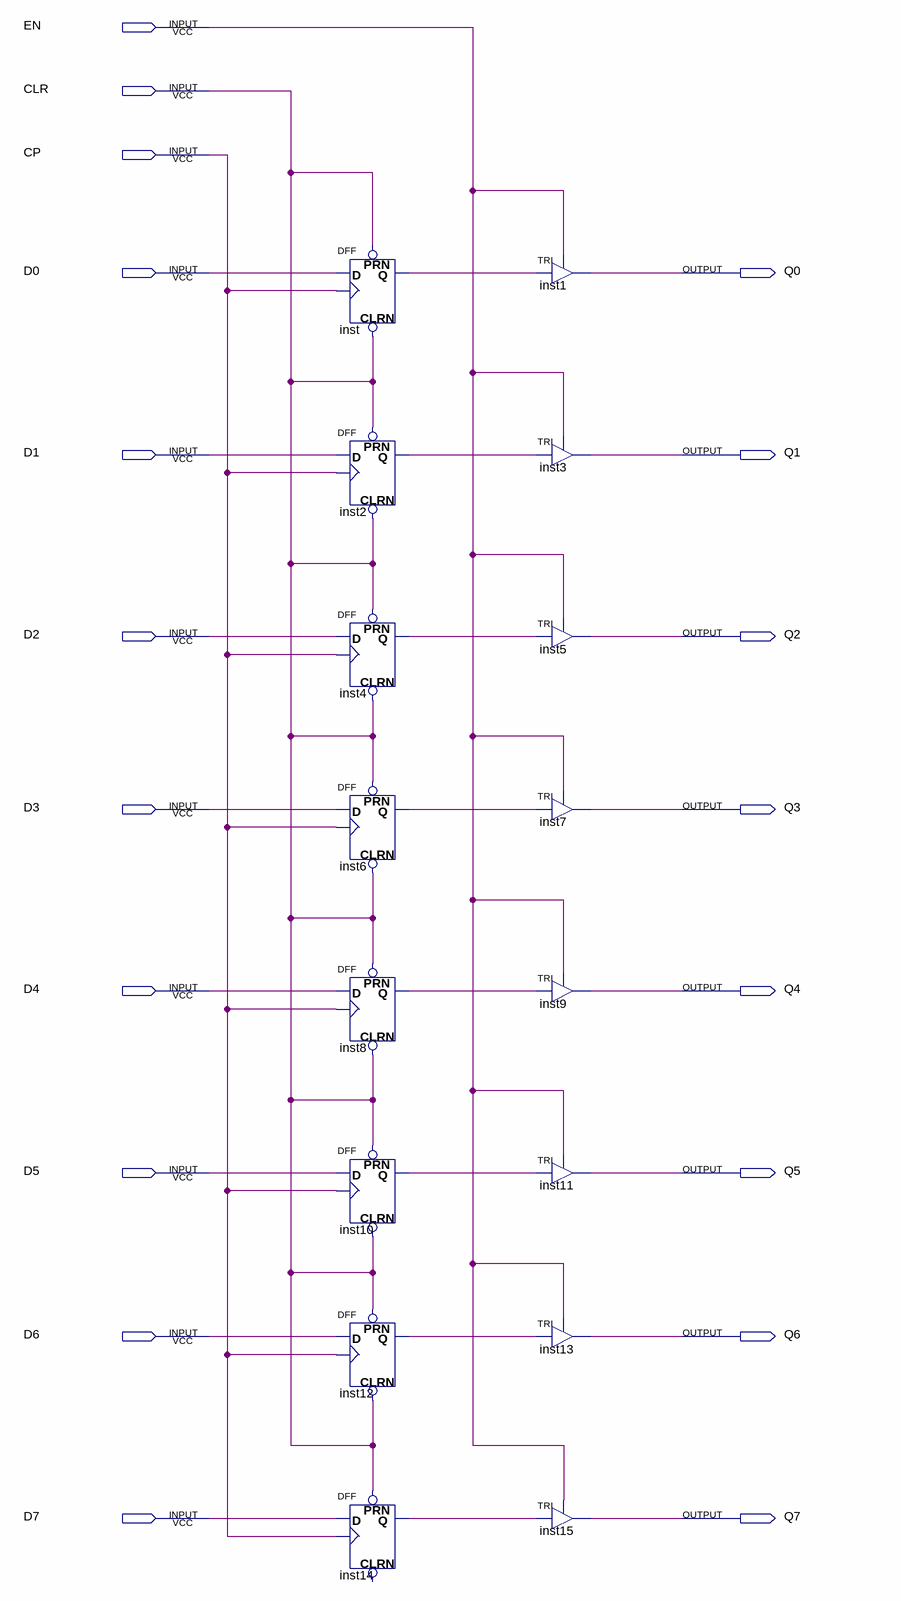
[diagram p0: schematic sheet]
// Quartus schematic 8-register.bdf as structural Verilog: 16 symbols, 19 pins
module \8-register  (
  input  EN,
  input  CLR,
  input  CP,
  input  D0,
  input  D1,
  input  D2,
  input  D3,
  input  D4,
  input  D5,
  input  D6,
  input  D7,
  output Q0,
  output Q1,
  output Q2,
  output Q3,
  output Q4,
  output Q5,
  output Q6,
  output Q7
);

  wire inst2_q, inst4_q, inst6_q, inst8_q, inst10_q, inst12_q, inst14_q, inst_q;

  DFF inst (.CLRN(CLR), .CLK(CP), .D(D0), .PRN(CLR), .Q(inst_q));
  DFF inst2 (.CLRN(CLR), .CLK(CP), .D(D1), .PRN(CLR), .Q(inst2_q));
  DFF inst4 (.CLRN(CLR), .CLK(CP), .D(D2), .PRN(CLR), .Q(inst4_q));
  DFF inst6 (.CLRN(CLR), .CLK(CP), .D(D3), .PRN(CLR), .Q(inst6_q));
  DFF inst8 (.CLRN(CLR), .CLK(CP), .D(D4), .PRN(CLR), .Q(inst8_q));
  DFF inst10 (.CLRN(CLR), .CLK(CP), .D(D5), .PRN(CLR), .Q(inst10_q));
  DFF inst12 (.CLRN(CLR), .CLK(CP), .D(D6), .PRN(CLR), .Q(inst12_q));
  DFF inst14 (.CLK(CP), .D(D7), .PRN(CLR), .Q(inst14_q));  // open: CLRN
  TRI inst1 (.IN(inst_q), .OE(EN), .OUT(Q0));
  TRI inst3 (.IN(inst2_q), .OE(EN), .OUT(Q1));
  TRI inst5 (.IN(inst4_q), .OE(EN), .OUT(Q2));
  TRI inst7 (.IN(inst6_q), .OE(EN), .OUT(Q3));
  TRI inst9 (.IN(inst8_q), .OE(EN), .OUT(Q4));
  TRI inst11 (.IN(inst10_q), .OE(EN), .OUT(Q5));
  TRI inst13 (.IN(inst12_q), .OE(EN), .OUT(Q6));
  TRI inst15 (.IN(inst14_q), .OE(EN), .OUT(Q7));
endmodule
